# Altium schematic sheet CM_FPGA_B2-3.SchDoc
size Tabloid; SheetNumber: 5; SheetTotal: 14; Sheet_Name: CM_FPGA_B2-3; Size: 11x17
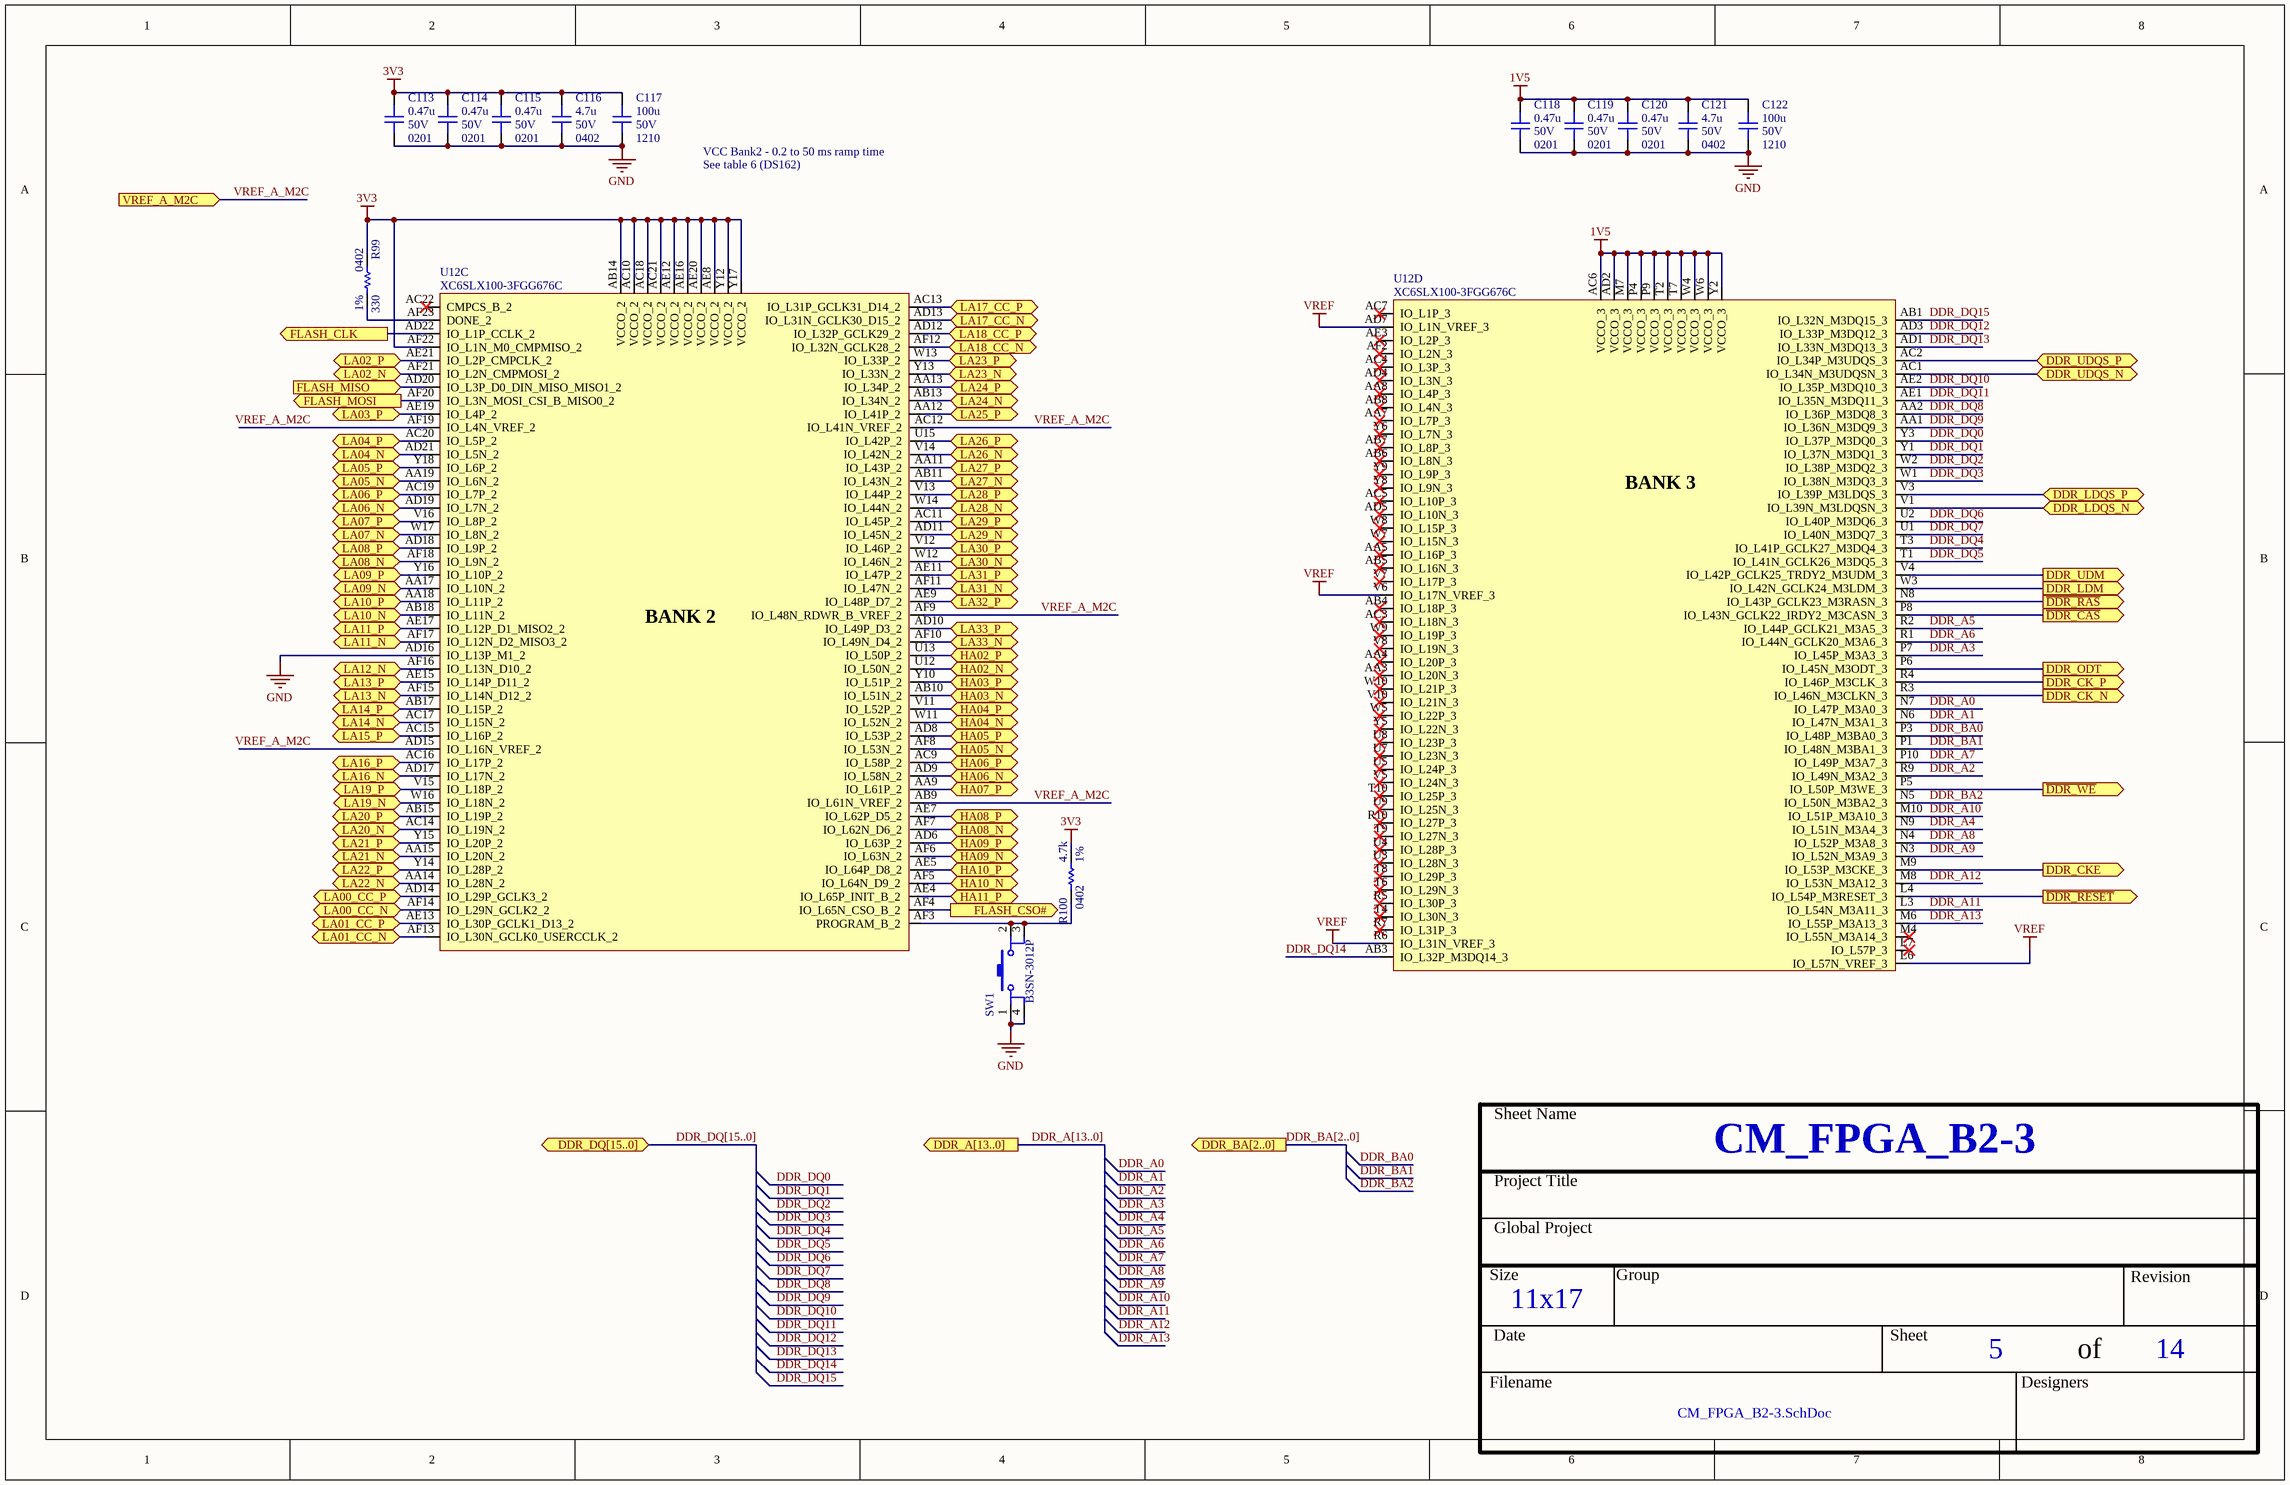
[diagram p0: CM_FPGA_B2-3.SchDoc]

## Parts
C113  value 0.47u  Voltage: 50V  Package: 0201  [CAP_0201]  (hidden comment: CAP - 0201)
C114  value 0.47u  Voltage: 50V  Package: 0201  [CAP_0201]  (hidden comment: CAP - 0201)
C115  value 0.47u  Voltage: 50V  Package: 0201  [CAP_0201]  (hidden comment: CAP - 0201)
C116  value 4.7u  Voltage: 50V  Package: 0402  [CAP_0402]  (hidden comment: CAP - 0402)
C117  value 100u  Voltage: 50V  Package: 1210  [CAP_1210]  (hidden comment: CAP - 1210)
C118  value 0.47u  Voltage: 50V  Package: 0201  [CAP_0201]  (hidden comment: CAP - 0201)
C119  value 0.47u  Voltage: 50V  Package: 0201  [CAP_0201]  (hidden comment: CAP - 0201)
C120  value 0.47u  Voltage: 50V  Package: 0201  [CAP_0201]  (hidden comment: CAP - 0201)
C121  value 4.7u  Voltage: 50V  Package: 0402  [CAP_0402]  (hidden comment: CAP - 0402)
C122  value 100u  Voltage: 50V  Package: 1210  [CAP_1210]  (hidden comment: CAP - 1210)
R99  value 330  Package: 0402  Precision: 1%  [RES_0402]  (hidden comment: RES - 0402)
R100  value 4.7k  Package: 0402  Precision: 1%  [RES_0402]  (hidden comment: RES - 0402)
SW1  B3SN-3012P  [SWI_TACT_B3SN-3012P]
U12  XC6SLX100-3FGG676C  [FPGA_XILINX_FGG676]  (parts C,D of 10)

## Ports
DDR_A[13..0] (out), DDR_BA[2..0] (out), DDR_CK_N (out), DDR_CK_P (out), DDR_CKE (out), DDR_DQ[15..0] (bidir), DDR_LDM (out), DDR_LDQS_N (bidir), DDR_LDQS_P (bidir), DDR_ODT (out), DDR_UDM (out), DDR_UDQS_N (bidir), DDR_UDQS_P (bidir), FLASH_CLK (out), FLASH_CSO# (out), FLASH_MISO (in), FLASH_MOSI (out), HA02_N (bidir), HA02_P (bidir), HA03_N (bidir), HA03_P (bidir), HA04_N (bidir), HA04_P (bidir), HA05_N (bidir), HA05_P (bidir), HA06_N (bidir), HA06_P (bidir), HA07_P (bidir), HA08_N (bidir), HA08_P (bidir), HA09_N (bidir), HA09_P (bidir), HA10_N (bidir), HA10_P (bidir), HA11_P (bidir), LA00_CC_N (bidir), LA00_CC_P (bidir), LA01_CC_N (bidir), LA01_CC_P (bidir), LA02_N (bidir), LA02_P (bidir), LA03_P (bidir), LA04_N (bidir), LA04_P (bidir), LA05_N (bidir), LA05_P (bidir), LA06_N (bidir), LA06_P (bidir), LA07_N (bidir), LA07_P (bidir), LA08_N (bidir), LA08_P (bidir), LA09_N (bidir), LA09_P (bidir), LA10_N (bidir), LA10_P (bidir), LA11_N (bidir), LA11_P (bidir), LA12_N (bidir), LA13_N (bidir), LA13_P (bidir), LA14_N (bidir), LA14_P (bidir), LA15_P (bidir), LA16_N (bidir), LA16_P (bidir), LA17_CC_N (bidir), LA17_CC_P (bidir), LA18_CC_N (bidir), LA18_CC_P (bidir), LA19_N (bidir), LA19_P (bidir), LA20_N (bidir), LA20_P (bidir), LA21_N (bidir), LA21_P (bidir), LA22_N (bidir), LA22_P (bidir), LA23_N (bidir), LA23_P (bidir), LA24_N (bidir), LA24_P (bidir), LA25_P (bidir), LA26_N (bidir), LA26_P (bidir), LA27_N (bidir), LA27_P (bidir), LA28_N (bidir), LA28_P (bidir), LA29_N (bidir), LA29_P (bidir), LA30_N (bidir), LA30_P (bidir), LA31_N (bidir), LA31_P (bidir), LA32_P (bidir), LA33_N (bidir), LA33_P (bidir), VREF_A_M2C (in), ~{DDR_CAS} (out), ~{DDR_RAS} (out), ~{DDR_RESET} (out), ~{DDR_WE} (out)

## Nets
1V5: C118.2 C119.2 C120.2 C121.2 C122.2 U12.AC6(VCCO_3) U12.AD2(VCCO_3) U12.M7(VCCO_3) U12.P4(VCCO_3) U12.P9(VCCO_3) U12.T2(VCCO_3) U12.T7(VCCO_3) U12.W4(VCCO_3) U12.W6(VCCO_3) U12.Y2(VCCO_3)
3V3: C113.2 C114.2 C115.2 C116.2 C117.2 R99.1 R100.2 U12.AB14(VCCO_2) U12.AC10(VCCO_2) U12.AC18(VCCO_2) U12.AC21(VCCO_2) U12.AE8(VCCO_2) U12.AE12(VCCO_2) U12.AE16(VCCO_2) U12.AE20(VCCO_2) U12.AF22(IO_L1N_M0_CMPMISO_2) U12.Y12(VCCO_2) U12.Y17(VCCO_2)
GND: C113.1 C114.1 C115.1 C116.1 C117.1 C118.1 C119.1 C120.1 C121.1 C122.1 SW1.1 SW1.4 U12.AD16(IO_L13P_M1_2)
VREF: U12.AD7(IO_L1N_VREF_3) U12.L6(IO_L57N_VREF_3) U12.R6(IO_L31N_VREF_3) U12.V6(IO_L17N_VREF_3)
~{DDR_CAS}: U12.P8(IO_L43N_GCLK22_IRDY2_M3CASN_3) ; port ~{DDR_CAS}
~{DDR_RAS}: U12.N8(IO_L43P_GCLK23_M3RASN_3) ; port ~{DDR_RAS}
~{DDR_RESET}: U12.L4(IO_L54P_M3RESET_3) ; port ~{DDR_RESET}
~{DDR_WE}: U12.P5(IO_L50P_M3WE_3) ; port ~{DDR_WE}
DDR_A0: U12.N7(IO_L47P_M3A0_3)
DDR_A1: U12.N6(IO_L47N_M3A1_3)
DDR_A2: U12.R9(IO_L49N_M3A2_3)
DDR_A3: U12.P7(IO_L45P_M3A3_3)
DDR_A4: U12.N9(IO_L51N_M3A4_3)
DDR_A5: U12.R2(IO_L44P_GCLK21_M3A5_3)
DDR_A6: U12.R1(IO_L44N_GCLK20_M3A6_3)
DDR_A7: U12.P10(IO_L49P_M3A7_3)
DDR_A8: U12.N4(IO_L52P_M3A8_3)
DDR_A9: U12.N3(IO_L52N_M3A9_3)
DDR_A10: U12.M10(IO_L51P_M3A10_3)
DDR_A11: U12.L3(IO_L54N_M3A11_3)
DDR_A12: U12.M8(IO_L53N_M3A12_3)
DDR_A13: U12.M6(IO_L55P_M3A13_3)
DDR_BA0: U12.P3(IO_L48P_M3BA0_3)
DDR_BA1: U12.P1(IO_L48N_M3BA1_3)
DDR_BA2: U12.N5(IO_L50N_M3BA2_3)
DDR_CK_N: U12.R3(IO_L46N_M3CLKN_3) ; port DDR_CK_N
DDR_CK_P: U12.R4(IO_L46P_M3CLK_3) ; port DDR_CK_P
DDR_CKE: U12.M9(IO_L53P_M3CKE_3) ; port DDR_CKE
DDR_DQ0: U12.Y3(IO_L37P_M3DQ0_3)
DDR_DQ1: U12.Y1(IO_L37N_M3DQ1_3)
DDR_DQ2: U12.W2(IO_L38P_M3DQ2_3)
DDR_DQ3: U12.W1(IO_L38N_M3DQ3_3)
DDR_DQ4: U12.T3(IO_L41P_GCLK27_M3DQ4_3)
DDR_DQ5: U12.T1(IO_L41N_GCLK26_M3DQ5_3)
DDR_DQ6: U12.U2(IO_L40P_M3DQ6_3)
DDR_DQ7: U12.U1(IO_L40N_M3DQ7_3)
DDR_DQ8: U12.AA2(IO_L36P_M3DQ8_3)
DDR_DQ9: U12.AA1(IO_L36N_M3DQ9_3)
DDR_DQ10: U12.AE2(IO_L35P_M3DQ10_3)
DDR_DQ11: U12.AE1(IO_L35N_M3DQ11_3)
DDR_DQ12: U12.AD3(IO_L33P_M3DQ12_3)
DDR_DQ13: U12.AD1(IO_L33N_M3DQ13_3)
DDR_DQ14: U12.AB3(IO_L32P_M3DQ14_3)
DDR_DQ15: U12.AB1(IO_L32N_M3DQ15_3)
DDR_LDM: U12.W3(IO_L42N_GCLK24_M3LDM_3) ; port DDR_LDM
DDR_LDQS_N: U12.V1(IO_L39N_M3LDQSN_3) ; port DDR_LDQS_N
DDR_LDQS_P: U12.V3(IO_L39P_M3LDQS_3) ; port DDR_LDQS_P
DDR_ODT: U12.P6(IO_L45N_M3ODT_3) ; port DDR_ODT
DDR_UDM: U12.V4(IO_L42P_GCLK25_TRDY2_M3UDM_3) ; port DDR_UDM
DDR_UDQS_N: U12.AC1(IO_L34N_M3UDQSN_3) ; port DDR_UDQS_N
DDR_UDQS_P: U12.AC2(IO_L34P_M3UDQS_3) ; port DDR_UDQS_P
FLASH_CLK: U12.AD22(IO_L1P_CCLK_2) ; port FLASH_CLK
FLASH_CSO#: U12.AF4(IO_L65N_CSO_B_2) ; port FLASH_CSO#
FLASH_MISO: U12.AD20(IO_L3P_D0_DIN_MISO_MISO1_2) ; port FLASH_MISO
FLASH_MOSI: U12.AF20(IO_L3N_MOSI_CSI_B_MISO0_2) ; port FLASH_MOSI
HA02_N: U12.U12(IO_L50N_2) ; port HA02_N
HA02_P: U12.U13(IO_L50P_2) ; port HA02_P
HA03_N: U12.AB10(IO_L51N_2) ; port HA03_N
HA03_P: U12.Y10(IO_L51P_2) ; port HA03_P
HA04_N: U12.W11(IO_L52N_2) ; port HA04_N
HA04_P: U12.V11(IO_L52P_2) ; port HA04_P
HA05_N: U12.AF8(IO_L53N_2) ; port HA05_N
HA05_P: U12.AD8(IO_L53P_2) ; port HA05_P
HA06_N: U12.AD9(IO_L58N_2) ; port HA06_N
HA06_P: U12.AC9(IO_L58P_2) ; port HA06_P
HA07_P: U12.AA9(IO_L61P_2) ; port HA07_P
HA08_N: U12.AF7(IO_L62N_D6_2) ; port HA08_N
HA08_P: U12.AE7(IO_L62P_D5_2) ; port HA08_P
HA09_N: U12.AF6(IO_L63N_2) ; port HA09_N
HA09_P: U12.AD6(IO_L63P_2) ; port HA09_P
HA10_N: U12.AF5(IO_L64N_D9_2) ; port HA10_N
HA10_P: U12.AE5(IO_L64P_D8_2) ; port HA10_P
HA11_P: U12.AE4(IO_L65P_INIT_B_2) ; port HA11_P
LA00_CC_N: U12.AF14(IO_L29N_GCLK2_2) ; port LA00_CC_N
LA00_CC_P: U12.AD14(IO_L29P_GCLK3_2) ; port LA00_CC_P
LA01_CC_N: U12.AF13(IO_L30N_GCLK0_USERCCLK_2) ; port LA01_CC_N
LA01_CC_P: U12.AE13(IO_L30P_GCLK1_D13_2) ; port LA01_CC_P
LA02_N: U12.AF21(IO_L2N_CMPMOSI_2) ; port LA02_N
LA02_P: U12.AE21(IO_L2P_CMPCLK_2) ; port LA02_P
LA03_P: U12.AE19(IO_L4P_2) ; port LA03_P
LA04_N: U12.AD21(IO_L5N_2) ; port LA04_N
LA04_P: U12.AC20(IO_L5P_2) ; port LA04_P
LA05_N: U12.AA19(IO_L6N_2) ; port LA05_N
LA05_P: U12.Y18(IO_L6P_2) ; port LA05_P
LA06_N: U12.AD19(IO_L7N_2) ; port LA06_N
LA06_P: U12.AC19(IO_L7P_2) ; port LA06_P
LA07_N: U12.W17(IO_L8N_2) ; port LA07_N
LA07_P: U12.V16(IO_L8P_2) ; port LA07_P
LA08_N: U12.AF18(IO_L9N_2) ; port LA08_N
LA08_P: U12.AD18(IO_L9P_2) ; port LA08_P
LA09_N: U12.AA17(IO_L10N_2) ; port LA09_N
LA09_P: U12.Y16(IO_L10P_2) ; port LA09_P
LA10_N: U12.AB18(IO_L11N_2) ; port LA10_N
LA10_P: U12.AA18(IO_L11P_2) ; port LA10_P
LA11_N: U12.AF17(IO_L12N_D2_MISO3_2) ; port LA11_N
LA11_P: U12.AE17(IO_L12P_D1_MISO2_2) ; port LA11_P
LA12_N: U12.AF16(IO_L13N_D10_2) ; port LA12_N
LA13_N: U12.AF15(IO_L14N_D12_2) ; port LA13_N
LA13_P: U12.AE15(IO_L14P_D11_2) ; port LA13_P
LA14_N: U12.AC17(IO_L15N_2) ; port LA14_N
LA14_P: U12.AB17(IO_L15P_2) ; port LA14_P
LA15_P: U12.AC15(IO_L16P_2) ; port LA15_P
LA16_N: U12.AD17(IO_L17N_2) ; port LA16_N
LA16_P: U12.AC16(IO_L17P_2) ; port LA16_P
LA17_CC_N: U12.AD13(IO_L31N_GCLK30_D15_2) ; port LA17_CC_N
LA17_CC_P: U12.AC13(IO_L31P_GCLK31_D14_2) ; port LA17_CC_P
LA18_CC_N: U12.AF12(IO_L32N_GCLK28_2) ; port LA18_CC_N
LA18_CC_P: U12.AD12(IO_L32P_GCLK29_2) ; port LA18_CC_P
LA19_N: U12.W16(IO_L18N_2) ; port LA19_N
LA19_P: U12.V15(IO_L18P_2) ; port LA19_P
LA20_N: U12.AC14(IO_L19N_2) ; port LA20_N
LA20_P: U12.AB15(IO_L19P_2) ; port LA20_P
LA21_N: U12.AA15(IO_L20N_2) ; port LA21_N
LA21_P: U12.Y15(IO_L20P_2) ; port LA21_P
LA22_N: U12.AA14(IO_L28N_2) ; port LA22_N
LA22_P: U12.Y14(IO_L28P_2) ; port LA22_P
LA23_N: U12.Y13(IO_L33N_2) ; port LA23_N
LA23_P: U12.W13(IO_L33P_2) ; port LA23_P
LA24_N: U12.AB13(IO_L34N_2) ; port LA24_N
LA24_P: U12.AA13(IO_L34P_2) ; port LA24_P
LA25_P: U12.AA12(IO_L41P_2) ; port LA25_P
LA26_N: U12.V14(IO_L42N_2) ; port LA26_N
LA26_P: U12.U15(IO_L42P_2) ; port LA26_P
LA27_N: U12.AB11(IO_L43N_2) ; port LA27_N
LA27_P: U12.AA11(IO_L43P_2) ; port LA27_P
LA28_N: U12.W14(IO_L44N_2) ; port LA28_N
LA28_P: U12.V13(IO_L44P_2) ; port LA28_P
LA29_N: U12.AD11(IO_L45N_2) ; port LA29_N
LA29_P: U12.AC11(IO_L45P_2) ; port LA29_P
LA30_N: U12.W12(IO_L46N_2) ; port LA30_N
LA30_P: U12.V12(IO_L46P_2) ; port LA30_P
LA31_N: U12.AF11(IO_L47N_2) ; port LA31_N
LA31_P: U12.AE11(IO_L47P_2) ; port LA31_P
LA32_P: U12.AE9(IO_L48P_D7_2) ; port LA32_P
LA33_N: U12.AF10(IO_L49N_D4_2) ; port LA33_N
LA33_P: U12.AD10(IO_L49P_D3_2) ; port LA33_P
VREF_A_M2C: U12.AB9(IO_L61N_VREF_2) U12.AC12(IO_L41N_VREF_2) U12.AD15(IO_L16N_VREF_2) U12.AF9(IO_L48N_RDWR_B_VREF_2) U12.AF19(IO_L4N_VREF_2) ; port VREF_A_M2C
NetR99_2: R99.2 U12.AF23(DONE_2)
NetR100_1: R100.1 SW1.2 SW1.3 U12.AF3(PROGRAM_B_2)

Not connected (* = marked no-connect by the designer): U12 AA3(IO_L20N_3)* AA4(IO_L20P_3)* AA5(IO_L16P_3)* AA7(IO_L7P_3)* AA8(IO_L4P_3)* AB4(IO_L18P_3)* AB5(IO_L16N_3)* AB6(IO_L8N_3)* AB7(IO_L8P_3)* AB8(IO_L4N_3)* AC3(IO_L18N_3)* AC4(IO_L3P_3)* AC5(IO_L10P_3)* AC7(IO_L1P_3)* AC22(CMPCS_B_2)* AD4(IO_L3N_3)* AD5(IO_L10N_3)* AE3(IO_L2P_3)* AF2(IO_L2N_3)* L7(IO_L57P_3)* M4(IO_L55N_M3A14_3)* R5(IO_L30P_3)* R7(IO_L31P_3)* R10(IO_L27P_3)* T4(IO_L30N_3)* T6(IO_L29N_3)* T8(IO_L29P_3)* T9(IO_L27N_3)* T10(IO_L25P_3)* U3(IO_L28N_3)* U4(IO_L28P_3)* U5(IO_L24P_3)* U7(IO_L23N_3)* U8(IO_L23P_3)* U9(IO_L25N_3)* V5(IO_L24N_3)* V7(IO_L17P_3)* V8(IO_L19N_3)* V10(IO_L21N_3)* W5(IO_L22P_3)* W7(IO_L15N_3)* W8(IO_L15P_3)* W9(IO_L19P_3)* W10(IO_L21P_3)* Y5(IO_L22N_3)* Y6(IO_L7N_3)* Y8(IO_L9N_3)* Y9(IO_L9P_3)*

## Buses and harness runs
bus DDR_A[13..0] = port DDR_A[13..0]
bus DDR_BA[2..0] = port DDR_BA[2..0]
bus DDR_DQ[15..0] = port DDR_DQ[15..0]

## Notes on the sheet
- VCC Bank2 - 0.2 to 50 ms ramp time
- See table 6 (DS162)
- Sheet Name
- Project Title
- Global Project
- Size
- Group
- Revision
- Date
- Sheet
- of
- Filename
- Designers
- (in symbol FPGA_XC6SLX100-3FGG676C, part C) BANK 2
- (in symbol FPGA_XC6SLX100-3FGG676C, part D) BANK 3

## Library data of the parts
C113-C115 C118-C120 = CAP - 0201: Precision: 10%; Current: *; CreatedBy: Jonathan Bouchard; Power: *
C116 C121 = CAP - 0402: Precision: 10%; Current: *; CreatedBy: Jonathan Bouchard; Power: *
C117 C122 = CAP - 1210: Precision: 10%; Current: *; CreatedBy: Jonathan Bouchard; Power: *
R99 R100 = RES - 0402: Voltage: 50V; Power: 1/16W; Current: *; CreatedBy: Jonathan Bouchard
SW1 = SWI_TACT_B3SN-3012P: SWI - TACT SPST-NO 0.05A 24V - 4-SMD; Current: 50mA; Mfg: Omron; Mfg Part Number: B3SN-3012P; HelpURL: http://www.omron.com/ecb/products/pdf/en-b3sn.pdf; CreatedBy: Jonathan Bouchard; Temperature: -25°C ~ 70°C; Power: *; Precision: *; Package: 4-SMD; Value: *; Voltage: 24V; Supplier 1: Digikey; Supplier Part Number 1: SW261CT-ND
U12 = FPGA_XC6SLX100-3FGG676C: FPGA - XILINX SPARTAN 6 480 I/O - BGA-676; Voltage: 1.14 V ~ 1.26 V; Current: *; Power: *; Mfg: Xilinx; Mfg Part Number: XC6SLX100-3FGG676C; HelpURL: https://www.xilinx.com/support/documentation/data_sheets/ds162.pdf; CreatedBy: Jonathan Bouchard; Temperature: 0°C ~ 85°C (TJ); Value: *; Precision: *; Package: BGA-676; Supplier 1: Digikey; Supplier Part Number 1: 122-1760-ND